# Altium schematic sheet Sheet1.SchDoc
size A4
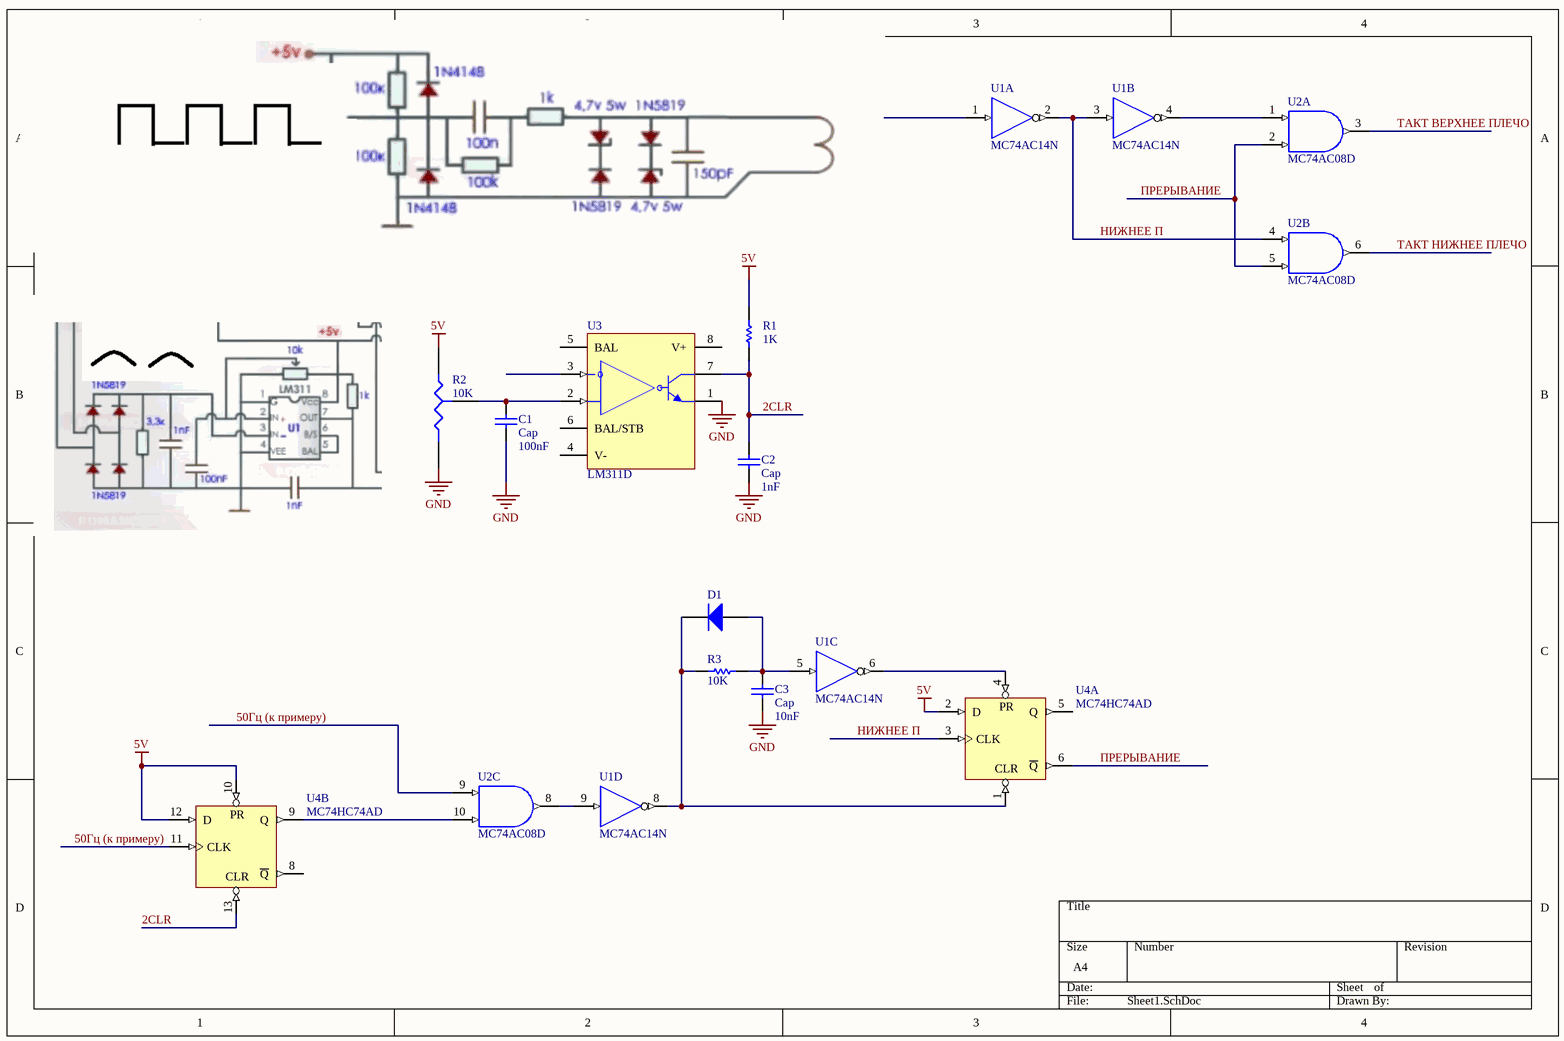
[diagram p0: Sheet1.SchDoc]

## Parts
C1  Cap  value 100nF  [RAD-0.3]
C2  Cap  value 1nF  [RAD-0.3]
C3  Cap  value 10nF  [RAD-0.3]
D1  Diode BAT18  [SOT-23_N]  (value not drawn)
R1  value 1K  [AXIAL-0.3]  (hidden comment: Res1)
R2  value 10K  [VR3]  (hidden comment: Res Tap)
R3  value 10K  [AXIAL-0.3]  (hidden comment: Res1)
U1  MC74AC14N  [646-06]  (parts A,B,C,D of 6)
U2  MC74AC08D  [751A-03_N]  (parts A,B,C of 4)
U3  LM311D  [D008_N]
U4  MC74HC74AD  [751A-03_N]  (parts A,B of 2)

## Nets
5V: R1.2 R2.1(A) U4.2(D) U4.10(PR) U4.12(D)
GND: C1.1 C2.1 C3.1 R2.2(B) U1.7(GND) U2.7(GND) U3.1(EM_OUT) U4.7(GND)
VDD: U1.14(VDD) U2.14(VDD) U4.14(VDD)
2CLR: C2.2 R1.1 U3.7(COL_OUT) U4.13(CLR)
50Гц (к примеру): U2.9(A) U4.11(CLK)
НИЖНЕЕ П: U1.2(~{OUT}) U1.3(IN) U2.4(A) U4.3(CLK)
ПРЕРЫВАНИЕ: U2.2(B) U2.5(B) U4.6(~{Q})
ТАКТ ВЕРХНЕЕ ПЛЕЧО: U2.3(Y)
ТАКТ НИЖНЕЕ ПЛЕЧО: U2.6(Y)
NetC1_2: C1.2 R2.3(TAP) U3.2(IN+)
NetC3_2: C3.2 D1.1(A) R3.1 U1.5(IN)
NetD1_3: D1.3(K) R3.2 U1.8(~{OUT}) U4.1(CLR)
NetU1_4: U1.4(~{OUT}) U2.1(A)
NetU1_6: U1.6(~{OUT}) U4.4(PR)
NetU1_9: U1.9(IN) U2.8(Y)
NetU2_10: U2.10(B) U4.9(Q)

Not connected (* = marked no-connect by the designer): U1 1(IN); U3 3(IN-) 4(V-) 5(BAL) 6(BAL/STB) 8(V+); U4 5(Q) 8(~{Q})

## Library data of the parts
C1-C3 = Cap: Capacitor; Published: 8-Jun-2000; LatestRevisionDate: 17-Jul-2002; LatestRevisionNote: Re-released for DXP Platform.; PackageReference: RAD-0.3; Publisher: Altium Limited; PackageDescription: Radial Cap, Thru-Hole; 2 Leads; 0.3 in Pin Spacing
D1 = Diode BAT18: Low-Loss RF Switching Diode; Note: Pin 2 is not connected and not drawn.; Published: 21-Mar-2003; LatestRevisionDate: 29-May-2009; LatestRevisionNote: IPC-7351 Footprint Added.; DatasheetVersion: Oct-1999; PackageVersion: Sep-2001; PackageReference: SOT-23; Publisher: Altium Limited; PackageDescription: 3-Pin SOT-23 Package 0.95 mm Pitch, 2.5 mm Lead Span; ComponentLink1Description: Manufacturer Link; ComponentLink1URL: http://www.infineon.com/
R1 R3 = Res1: Resistor; Published: 8-Jun-2000; LatestRevisionDate: 17-Jul-2002; LatestRevisionNote: Re-released for DXP Platform.; PackageReference: AXIAL-0.3; Publisher: Altium Limited; PackageDescription: Axial Device, Thru-Hole; 2 Leads; 0.3 in Pin Spacing
R2 = Res Tap: Tapped Resistor; Sim Note: Enter the Resistance value and the set point into parameter fields.; Set Position: 0.5; Published: 24-Mar-1999; LatestRevisionDate: 17-Jul-2002; LatestRevisionNote: Re-released for DXP Platform.; PackageReference: VR3; Publisher: Altium Limited; PackageDescription: Variable Resistor, Thru-Hole; 3 Leads
U1 = MC74AC14N: Hex Schmitt-Trigger Inverter; Published: 15-Apr-2002; DatasheetVersion: 9-Apr-1996; PackageVersion: 1995; PackageReference: 646-06; Publisher: Altium Limited; PackageDescription: DIP; 14 Leads; Row Spacing 7.62 mm; Pitch 2.54 mm; ComponentLink1Description: Manufacturer Link; ComponentLink1URL: http://www.onsemi.com/; ComponentLink2Description: Datasheet; ComponentLink2URL: http://www.onsemi.com/pub/Collateral/MC74AC14-D.PDF
U2 = MC74AC08D: Quad 2-Input AND Gate; Published: 15-Apr-2002; LatestRevisionDate: 13-Apr-2006; LatestRevisionNote: IPC-7351 Footprint Added.; DatasheetVersion: 9-Apr-1996; PackageReference: 751A-03; Publisher: Altium Limited; PackageDescription: 14-Pin Small Outline Integrated Circuit 1.27 mm Pitch; Code_JEDEC: MS-012-AB; Code_IPC: SOIC127P600-14; ComponentLink1Description: Manufacturer Link; ComponentLink1URL: http://www.onsemi.com/; ComponentLink2Description: Datasheet; ComponentLink2URL: http://www.onsemi.com/pub/Collateral/MC74AC08-D.PDF
U3 = LM311D: Differential Comparator with Strobes; Published: 15-Apr-2002; LatestRevisionDate: 13-Apr-2006; LatestRevisionNote: IPC-7351 Footprint Added.; DatasheetVersion: Mar-1988; PackageVersion: Jan-1998; PackageReference: D008; Publisher: Altium Limited; PackageDescription: 8-Pin Small Outline Integrated Circuit 1.27 mm Pitch; Code_IPC: SOIC127P600-8; ComponentLink1Description: Manufacturer Link; ComponentLink1URL: http://www.ti.com/; ComponentLink2Description: Datasheet; ComponentLink2URL: http://www-s.ti.com/sc/ds/lm311.pdf
U4 = MC74HC74AD: Dual D-Type Flip-Flop with Set and Reset; Published: 15-Apr-2002; LatestRevisionDate: 13-Apr-2006; LatestRevisionNote: IPC-7351 Footprint Added.; DatasheetVersion: Mar-2000; PackageReference: 751A-03; Publisher: Altium Limited; PackageDescription: 14-Pin Small Outline Integrated Circuit 1.27 mm Pitch; Code_JEDEC: MS-012-AB; Code_IPC: SOIC127P600-14; ComponentLink1Description: Manufacturer Link; ComponentLink1URL: http://www.onsemi.com/; ComponentLink2Description: Datasheet; ComponentLink2URL: http://www.onsemi.com/pub/Collateral/MC74HC74A-D.PDF